# Altium schematic sheet 2SiPM_4.SchDoc
size A4
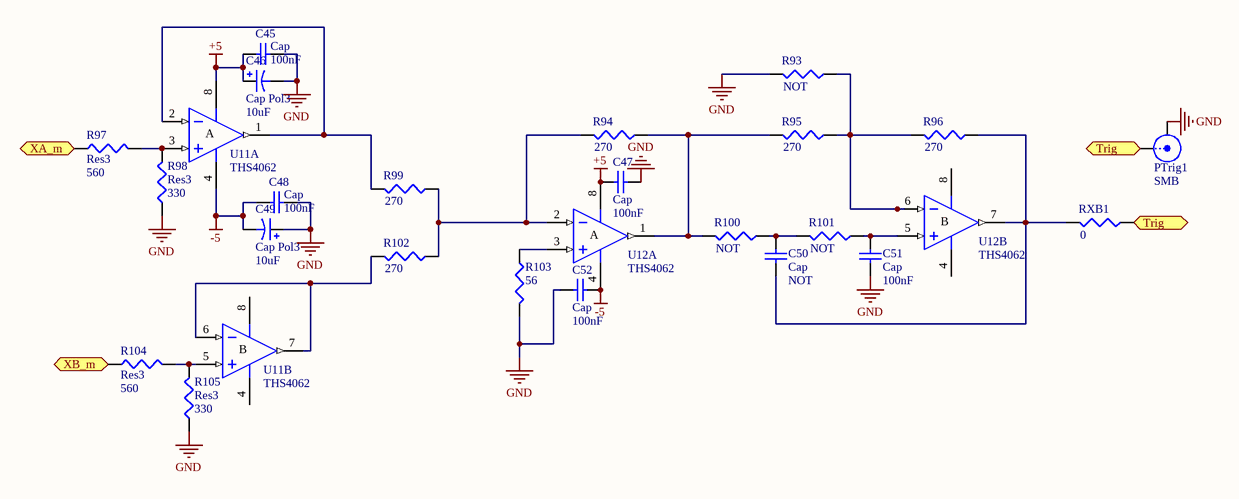
[diagram p0: 2SiPM_4.SchDoc]

## Parts
C45  Cap  value 100nF  [6-0805_N]
C46  Cap Pol3  value 10uF  [6-0805_N]
C47  Cap  value 100nF  [1608[0603]]
C48  Cap  value 100nF  [6-0805_N]
C49  Cap Pol3  value 10uF  [6-0805_N]
C50  Cap  value NOT  [1608[0603]]
C51  Cap  value 100nF  [1608[0603]]
C52  Cap  value 100nF  [1608[0603]]
PTrig1  SMB  [SMB_V-RJ45]
R93  value NOT  [J1-0603]  (hidden comment: Res3)
R94  value 270  [J1-0603]  (hidden comment: Res3)
R95  value 270  [J1-0603]  (hidden comment: Res3)
R96  value 270  [J1-0603]  (hidden comment: Res3)
R97  Res3  value 560  [J1-0603]
R98  Res3  value 330  [J1-0603]
R99  value 270  [J1-0603]  (hidden comment: Res3)
R100  value NOT  [J1-0603]  (hidden comment: Res3)
R101  value NOT  [J1-0603]  (hidden comment: Res3)
R102  value 270  [J1-0603]  (hidden comment: Res3)
R103  value 56  [J1-0603]  (hidden comment: Res3)
R104  Res3  value 560  [J1-0603]
R105  Res3  value 330  [J1-0603]
RXB1  value 0  [J1-0603]  (hidden comment: Res3)
U11  THS4062  [SO-8_M]  (parts A,B of 2)
U12  THS4062  [SO8_M]  (parts A,B of 2)

## Ports
Trig (out), XA_m (out), XB_m (out)

## Nets
+5: C45.2 C46.1 C47.1 U11.8(V+) U12.8(V+)
-5: C48.2 C49.2 C52.2 U11.4(V-) U12.4(V-)
GND: C45.1 C46.2 C47.2 C48.1 C49.1 C51.2 C52.1 PTrig1.2(Y) R93.2 R98.1 R103.2 R105.1
Trig: PTrig1.1(X) RXB1.1 ; port Trig
XA_m: R97.1 ; port XA_m
XB_m: R104.1 ; port XB_m
NetC50_1: C50.1 R100.1 R101.2
NetC50_2: C50.2 R96.1 RXB1.2 U12.7(OUT)
NetC51_1: C51.1 R101.1 U12.5(IN+)
NetR93_1: R93.1 R95.1 R96.2 U12.6(IN-)
NetR94_1: R94.1 R95.2 R100.2 U12.1(OUT)
NetR94_2: R94.2 R99.1 R102.1 U12.2(IN-)
NetR97_2: R97.2 R98.2 U11.3(IN+)
NetR99_2: R99.2 U11.1(OUT) U11.2(IN-)
NetR102_2: R102.2 U11.6(IN-) U11.7(OUT)
NetR103_1: R103.1 U12.3(IN+)
NetR104_2: R104.2 R105.2 U11.5(IN+)

## Notes on the sheet
- (in symbol AD8002AR, part A) A
- (in symbol AD8002AR, part B) B
- (in symbol AD8056ARM, part A) A
- (in symbol AD8056ARM, part B) B

## Library data of the parts
C45 C47 C48 C50-C52 = Cap: Capacitor; Published: 8-Jun-2000; LatestRevisionDate: 17-Jul-2002; LatestRevisionNote: Re-released for DXP Platform.; PackageReference: RAD-0.3; Publisher: Altium Limited; PackageDescription: Radial Cap, Thru-Hole; 2 Leads; 0.3 in Pin Spacing
C46 C49 = Cap Pol3: Polarized Capacitor (Surface Mount); Published: 8-Jun-2000; LatestRevisionDate: 29-May-2009; LatestRevisionNote: IPC-7351 Footprint Added.; PackageReference: C0805; Publisher: Altium Limited; PackageDescription: Chip Capacitor
PTrig1 = SMB: SMB Straight Connector; LatestRevisionDate: 17-Jul-2002; LatestRevisionNote: Re-released for DXP Platform.; Publisher: Altium Limited
R93-R105 RXB1 = Res3: Resistor; Published: 8-Jun-2000; LatestRevisionDate: 29-May-2009; LatestRevisionNote: IPC-7351 Footprint Added.; PackageReference: J1-0603; Publisher: Altium Limited; PackageDescription: Chip Resistor
U11 = AD8002AR: Dual 600MHz, 50mW Current Feedback Amplifier; Published: 8-Jun-2000; LatestRevisionDate: 13-Apr-2006; LatestRevisionNote: IPC-7351 Footprint Added.; DatasheetVersion: REV. C 1999; PackageVersion: revA; PackageReference: SO-8; Publisher: Altium Limited; PackageDescription: 8-Pin Small Outline Integrated Circuit 1.27 mm Pitch; Code_JEDEC: MS-012-AA; Code_IPC: SOIC127P600-8; ComponentLink1Description: Manufacturer Link; ComponentLink1URL: http://www.analog.com/en/prod/0,,759_786_AD8002%2C00.html; ComponentLink2Description: Datasheet; ComponentLink2URL: http://www.analog.com/UploadedFiles/Data_Sheets/147523773AD8002_d.pdf
U12 = AD8056ARM: Low Cost, 300MHz Voltage Feedback Amplifier; Published: 8-Jun-2000; LatestRevisionDate: 04-Mar-2005; LatestRevisionNote: Stylized 3D Model Added, PCB footprint pad width decreased.; DatasheetVersion: REV. 0 1997; PackageVersion: 2004; PackageReference: RM-8; Publisher: Altium Limited; PackageDescription: Shrink Small Outline, MSOP; 8 Leads; Body Width 3 mm; Pitch 0.65 mm; Code_JEDEC: MO-187-AA; ComponentLink1Description: Manufacturer Link; ComponentLink1URL: http://www.analog.com/en/prod/0,,759_786_AD8055%2C00.html; ComponentLink2Description: Datasheet; ComponentLink2URL: http://www.analog.com/UploadedFiles/Data_Sheets/40402558757264AD8055_6_i.pdf